# Altium project Buck_Boost.PrjPcb
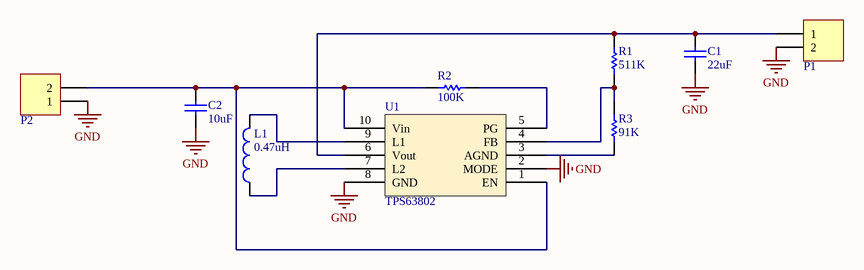
[diagram p0: Buck_Boost.SchDoc]
1 sheet, 9 parts. Net scope: global (net labels, ports and power ports of the same name join across sheets).
Board file: Buck_Boost.PcbDoc

## Sheet Buck_Boost.SchDoc
size Letter

### Parts
C1  value 22uF  [CAP-SM-0603]  (hidden comment: Cap Non-Pol SMD)
C2  value 10uF  [CAP-SM-0603]  (hidden comment: Cap Non-Pol SMD)
L1  value 0.47uH  [INDUCTOR 12.5x12.5]  (hidden comment: Inductor)
P1  Domino 2  [DOMINO 2- 5mm]  (value not drawn)
P2  Domino 2  [DOMINO 2- 5mm]  (value not drawn)
R1  value 511K  [RES-SM-0603]  (hidden comment: RESISTOR SMD)
R2  value 100K  [RES-SM-0603]  (hidden comment: RESISTOR SMD)
R3  value 91K  [RES-SM-0603]  (hidden comment: RESISTOR SMD)
U1  TPS63802  [TPS63802]

### Nets
GND: C1.2 C2.2 P1.2 P2.1 U1.2(MODE) U1.8(GND)
NetC1_1: C1.1 P1.1 R1.2 U1.6(Vout)
NetC2_1: C2.1 P2.2 R2.1 U1.1(EN) U1.10(Vin)
NetL1_1: L1.1 U1.7(L2)
NetL1_2: L1.2 U1.9(L1)
NetR1_1: R1.1 R3.2 U1.4(FB)
NetR2_2: R2.2 U1.5(PG)
NetR3_1: R3.1 U1.3(AGND)

### Library data of the parts
C1 C2 = Cap Non-Pol SMD: Capacitor
P1 P2 = Domino 2: Domino, 2-Pin; LatestRevisionDate: 17-Jul-2002; LatestRevisionNote: Re-released for DXP Platform.; Publisher: Altium Limited
R1-R3 = RESISTOR SMD: Resistor
U1 = TPS63802: SMD